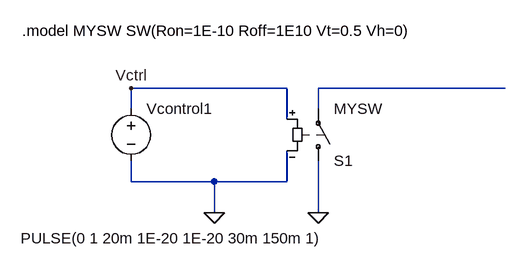
[diagram p0: schematic power_supply_P16.A.asc]
power_supply_P16.A.asc, the LTspice schematic file:
Version 4
SHEET 1 1232 680
WIRE 224 64 -16 64
WIRE 560 64 272 64
WIRE -16 96 -16 64
WIRE 272 96 272 64
WIRE 224 112 224 64
WIRE -16 208 -16 176
WIRE 112 208 -16 208
WIRE 224 208 224 160
WIRE 224 208 112 208
WIRE 112 256 112 208
WIRE 272 256 272 176
FLAG 112 256 0
FLAG 272 256 0
FLAG -16 64 Vctrl
SYMBOL sw 272 192 M180
SYMATTR InstName S1
SYMATTR Value MYSW
SYMBOL voltage -16 80 R0
WINDOW 3 -170 215 Left 2
WINDOW 123 0 0 Left 0
WINDOW 39 0 0 Left 0
SYMATTR Value PULSE(0 1 20m 1E-20 1E-20 30m 150m 1)
SYMATTR InstName Vcontrol1
TEXT -184 -24 Left 2 !.model MYSW SW(Ron=1E-10 Roff=1E10 Vt=0.5 Vh=0)

The netlist it stands for:
* power_supply_P16.A.asc
S1 0 N001 Vctrl 0 MYSW
Vcontrol1 Vctrl 0 PULSE(0 1 20m 1E-20 1E-20 30m 150m 1)
.model MYSW SW(Ron=1E-10 Roff=1E10 Vt=0.5 Vh=0)
.backanno
.end